# EAGLE design RPi_RN2483backup (EAGLE 7.6.0)
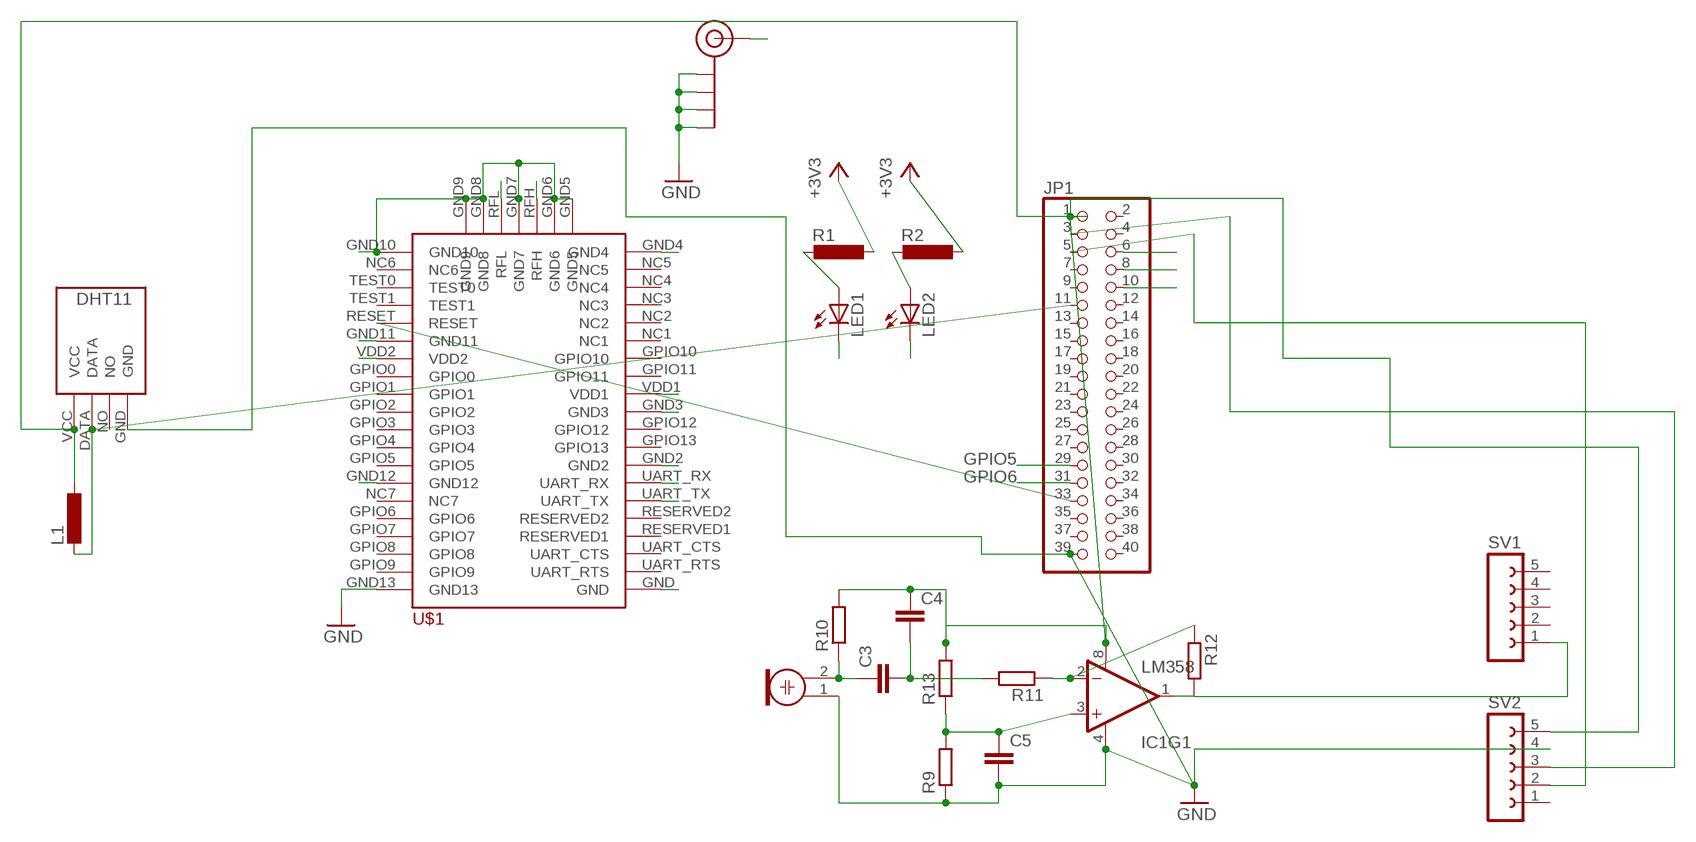
[diagram p0: schematic, sheet 1]

## Parts
C3  C-EU025-024X044  [C025-024X044]
C4  C-EU025-024X044  [C025-024X044]
C5  C-EU025-024X044  [C025-024X044]
IC1  LM358  [DIP08]
J$1  SMA_EDGE  [SMA-EDGE]
JP1  PINHD-2X20  [2X20]
L1  L-EU0204/7  [0204/7]
LED1  LED5MM  [LED5MM]
LED2  LED5MM  [LED5MM]
M1  ELECTRET_MICROPHON-F6050AP  [F6050AP]
R1  L-EU0204/7  [0204/7]
R2  L-EU0204/7  [0204/7]
R9  R-EU_0204/7  [0204/7]
R10  R-EU_0204/7  [0204/7]
R11  R-EU_0204/7  [0204/7]
R12  R-EU_0204/7  [0204/7]
R13  R-EU_0204/7  [0204/7]
SV1  FE05-1  [FE05-1]
SV2  FE05-1  [FE05-1]
U$1  RN2483  [RN2483]
U$3  DHT11-PION.  [DHT11-PION.]

## Nets
+3V3: C4.1 IC1.8(V+) JP1.1 L1.1 R1.1 R2.1 R10.2 R13.2 SV2.5 U$1.VDD1 U$1.VDD2 U$3.VCC
GND: J$1.GND@0(GND) J$1.GND@1(GND) J$1.GND@2(GND) J$1.GND@3(GND) U$1.GND U$1.GND2 U$1.GND3 U$1.GND4 U$1.GND5 U$1.GND6 U$1.GND7 U$1.GND8 U$1.GND9 U$1.GND10 U$1.GND11 U$1.GND12 U$1.GND13
GPIO5: JP1.29 LED1.K(C)
GPIO6: JP1.31 LED2.K(C)
GROUND: C5.2 IC1.4(V-) JP1.6 JP1.39 M1.1 R9.1 SV2.4 U$3.GND ; supply symbol labelled GND
N$1: LED1.A R1.2
N$2: LED2.A R2.2
N$7: U$1.RFL
N$10: JP1.11 L1.2 U$3.DATA
N$12: IC1.2(-IN) R11.1 R12.1
N$13: JP1.33 U$1.RESET
N$15: JP1.5 SV2.2
N$16: JP1.3 SV2.3
N$18: IC1.1(OUT) R12.2 SV1.1
N$22: C3.1 M1.2 R10.1
N$23: C3.2 C4.2 R11.2
N$24: C5.1 IC1.3(+IN) R9.2 R13.1
RFH: J$1.SIG(SIGNAL) U$1.RFH
UART_RX: JP1.8 U$1.UART_RX
UART_TX: JP1.10 U$1.UART_TX
Unconnected: IC1.5(+IN) IC1.6(-IN) IC1.7(OUT) JP1.2 JP1.4 JP1.7 JP1.9 JP1.12 JP1.13 JP1.14 JP1.15 JP1.16 JP1.17 JP1.18 JP1.19 JP1.20 JP1.21 JP1.22 JP1.23 JP1.24 JP1.25 JP1.26 JP1.27 JP1.28 JP1.30 JP1.32 JP1.34 JP1.35 JP1.36 JP1.37 JP1.38 JP1.40 SV1.2 SV1.3 SV1.4 SV1.5 SV2.1 U$1.GPIO0 U$1.GPIO1 U$1.GPIO2 U$1.GPIO3 U$1.GPIO4 U$1.GPIO5 U$1.GPIO6 U$1.GPIO7 U$1.GPIO8 U$1.GPIO9 U$1.GPIO10 U$1.GPIO11 U$1.GPIO12 U$1.GPIO13 U$1.NC1 U$1.NC2 U$1.NC3 U$1.NC4 U$1.NC5 U$1.NC6 U$1.NC7 U$1.RESERVED1 U$1.RESERVED2 U$1.TEST0 U$1.TEST1 U$1.UART_CTS U$1.UART_RTS U$3.NO

## Library data of the parts
C3-C5 = resistor:C-EU: CAPACITOR, European symbol
IC1 = SparkFun-AnalogIC:LM358: Jellybean op-amp; PROD_ID: IC-09172
J$1 = SparkFun-Connectors:SMA_EDGE: SMA Antenna Connector End launch SMA connector. The paste layer has been removed so that the connector can be hand soldered onto the board after reflow.
JP1 = adafruit:PINHD-2X20: PIN HEADER
L1 R1 R2 = resistor:L-EU: INDUCTOR, European symbol
LED1 LED2 = adafruit:LED: LED OSRAM: - CHIPLED LG R971, LG N971, LY N971, LG Q971, LY Q971, LO R971, LY R971 LH N974, LH R974 LS Q976, LO Q976, LY Q976 LO Q996 - Hyper CHIPLED LW Q18S LB Q993, LB Q99A, LB R99A - SideLED LS A670, LO A670, LY A670, LG A670, LP A670 LB A673, LV A673, LT A673, LW A673 LH A674 LY A675 LS A676, LA A676, LO A676, LY A676, LW A676 LS A679, LY A679, LG A679 - Hyper Micro SIDELED® LS Y876, LA Y876, LO Y876, LY Y876 LT Y87S - SmartLED LW L88C, LW L88S LB L89C, LB L89S, LG L890 LS L89K, LO L89K, LY L89K LS L896, LA L896, LO L896, LY L896 - TOPLED LS T670, LO T670, LY T670, LG T670, LP T670 LSG T670, LSP T670, LSY T670, LOP T670, LYG T670 LG T671, LOG T671, LSG T671 LB T673, LV T673, LT T673, LW T673 LH T674 LS T676, LA T676, LO T676, LY T676, LB T676, LH T676, LSB T676, LW T676 LB T67C, LV T67C, LT T67C, LS T67K, LO T67K, LY T67K, LW E67C LS E67B, LA E67B, LO E67B, LY E67B, LB E67C, LV E67C, LT E67C LW T67C LS T679, LY T679, LG T679 LS T770, LO T770, LY T770, LG T770, LP T770 LB T773, LV T773, LT T773, LW T773 LH T774 LS E675, LA E675, LY E675, LS T675 LS T776, LA T776, LO T776, LY T776, LB T776 LHGB T686 LT T68C, LB T68C - Hyper Mini TOPLED® LB M676 - Mini TOPLED Santana® LG M470 LS M47K, LO M47K, LY M47K Source: http://www.osram.convergy.de/
M1 = microphon:ELECTRET_MICROPHON-: Electret Condenser Microphone
R9-R13 = resistor:R-EU_: RESISTOR, European symbol
SV1 SV2 = con-lsta:FE05-1: FEMALE HEADER; OC_FARNELL: unknown; OC_NEWARK: unknown
U$1 = RN2483:RN2483: Microchip RN2483 LoRaWAN Module
U$3 = DHT11:DHT11-PION.: DHT11 Czujnik temperatury i wilgotności (widok pionowy)

## Module HDT11
Ports: 

### Library data of the parts

## Board
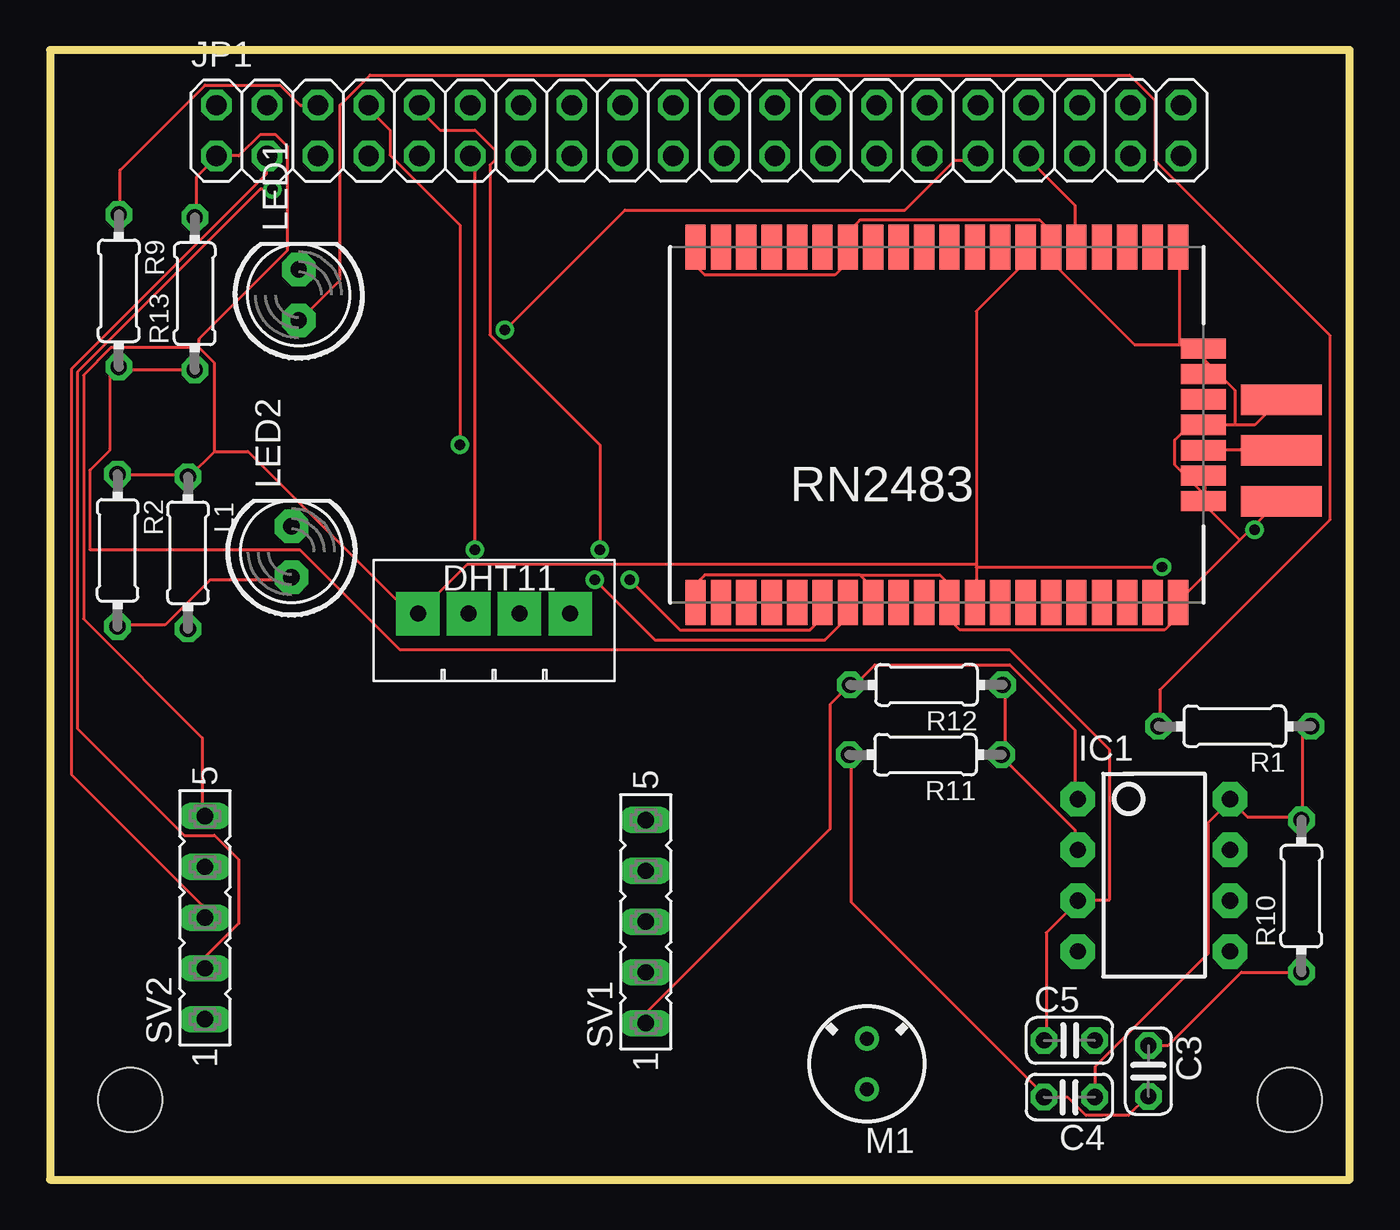
[diagram p1: board, top side]
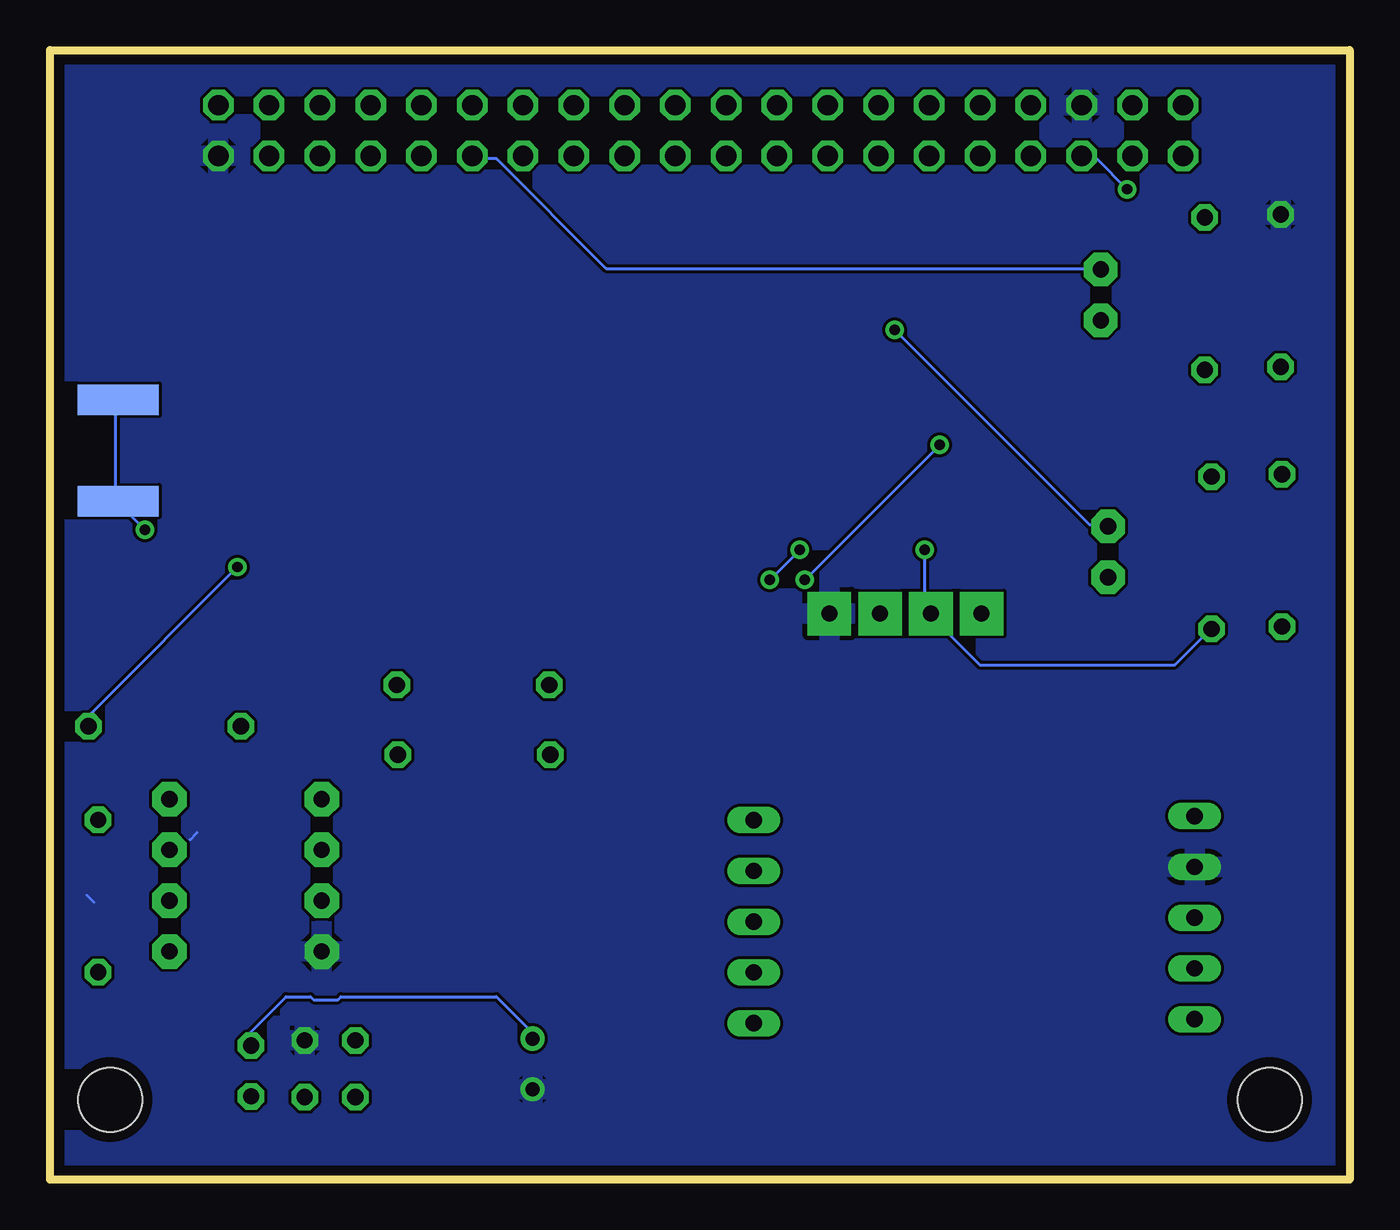
[diagram p2: board, bottom side, seen from below]

Size 65 x 56.5 mm. Coordinates in mm from the lower left corner, seen from the top.
Outline: 0,0 65,0 65,56.5 0,56.5 0,0
Copper layers (1*16): Top 0.035mm / dielectric 1.5mm / Bottom 0.035mm
Design rules "Ragworm": minimum track width 6mil, minimum drill 20mil, track to track 6mil, track to pad 6mil, pad to pad 6mil, via to via 6mil, smd to smd 6mil, copper to edge 20mil, drill to drill 8mil, minimum pad ring 10mil, minimum via ring 8mil, stop-mask expansion 4mil, vias tented up to drill 0mil, thermal gap 10mil
Holes 3.2 mm at 4,4 62,4

### Footprints (pad centres in the part's own frame; a part is rotated, then mirrored left to right if it is on the bottom)
C025-024X044 = drill 0.813 octagon: 1 -1.27,0; 2 1.27,0
DIP08 = drill 0.813 pad 1.727 octagon: 1 -3.81,-3.81; 2 -1.27,-3.81; 3 1.27,-3.81; 4 3.81,-3.81; 5 3.81,3.81; 6 1.27,3.81; 7 -1.27,3.81; 8 -3.81,3.81
SMA-EDGE = smd 1.524 x 4.064: GND@0 0,0; GND@1 5.08,0; SIG 2.54,0 | smd 1.524 x 4.064 bottom: GND@2 0,0; GND@3 5.08,0
2X20 = drill 1.016 octagon: 1 -24.13,-1.27; 2 -24.13,1.27; 3 -21.59,-1.27; 4 -21.59,1.27; 5 -19.05,-1.27; 6 -19.05,1.27; 7 -16.51,-1.27; 8 -16.51,1.27; 9 -13.97,-1.27; 10 -13.97,1.27; 11 -11.43,-1.27; 12 -11.43,1.27; 13 -8.89,-1.27; 14 -8.89,1.27; 15 -6.35,-1.27; 16 -6.35,1.27; 17 -3.81,-1.27; 18 -3.81,1.27; 19 -1.27,-1.27; 20 -1.27,1.27; 21 1.27,-1.27; 22 1.27,1.27; 23 3.81,-1.27; 24 3.81,1.27; 25 6.35,-1.27; 26 6.35,1.27; 27 8.89,-1.27; 28 8.89,1.27; 29 11.43,-1.27; 30 11.43,1.27; 31 13.97,-1.27; 32 13.97,1.27; 33 16.51,-1.27; 34 16.51,1.27; 35 19.05,-1.27; 36 19.05,1.27; 37 21.59,-1.27; 38 21.59,1.27; 39 24.13,-1.27; 40 24.13,1.27
0204/7 = drill 0.813 octagon: 1 -3.81,0; 2 3.81,0
LED5MM = drill 0.813 pad 1.676 octagon: A -1.27,0; K 1.27,0
F6050AP = drill 0.7 pad 1.2: 1 0,1.27; 2 0,-1.27
FE05-1 = drill 0.813 long: 1 -5.08,0; 2 -2.54,0; 3 0,0; 4 2.54,0; 5 5.08,0
RN2483 = smd 2.25 x 1.016: GND 17.78,1.27; GND2 17.78,10.16; GND3 17.78,13.97; GND4 17.78,25.4; GND10 0,25.4; GND11 0,19.05; GND12 0,8.89; GND13 0,1.27; GPIO0 0,16.51; GPIO1 0,15.24; GPIO2 0,13.97; GPIO3 0,12.7; GPIO4 0,11.43; GPIO5 0,10.16; GPIO6 0,6.35; GPIO7 0,5.08; GPIO8 0,3.81; GPIO9 0,2.54; GPIO10 17.78,17.78; GPIO11 17.78,16.51; GPIO12 17.78,12.7; GPIO13 17.78,11.43; NC1 17.78,19.05; NC2 17.78,20.32; NC3 17.78,21.59; NC4 17.78,22.86; NC5 17.78,24.13; NC6 0,24.13; NC7 0,7.62; RESERVED1 17.78,5.08; RESERVED2 17.78,6.35; RESET 0,20.32; TEST0 0,22.86; TEST1 0,21.59; UART_CTS 17.78,3.81; UART_RTS 17.78,2.54; UART_RX 17.78,8.89; UART_TX 17.78,7.62; VDD1 17.78,15.24; VDD2 0,17.78 | smd 1.016 x 2.25: GND5 12.7,26.67; GND6 11.43,26.67; GND7 8.89,26.67; GND8 6.35,26.67; GND9 5.08,26.67; RFH 10.16,26.67; RFL 7.62,26.67
DHT11-PION. = drill 0.8 pad 2.184 square: DATA -1.27,0.305; GND 3.81,0.305; NO 1.27,0.305; VCC -3.81,0.305

### Placement (x,y rotation side)
C3  54.94,5.43 270 top
C4  50.99,4.12 180 top
C5  50.99,6.96 0 top
IC1  55.22,15.22 270 top
J$1  61.59,39.01 270 top
JP1  32.45,52.47 0 top
L1  6.9,31.35 270 top
LED1  12.44,44.25 90 top
LED2  12.08,31.4 90 top
M1  40.86,5.78 180 top
R1  59.26,22.67 180 top
R2  3.38,31.47 270 top
R9  3.44,44.46 270 top
R10  62.59,14.18 90 top
R11  43.79,21.25 180 top
R12  43.84,24.74 180 top
R13  7.24,44.31 90 top
SV1  29.8,12.9 90 top
SV2  7.75,13.1 90 top
U$1  31.02,46.64 270 top
U$3  22.21,28 0 top

### Tracks (layer width: path | path; a pad name or v marks a point on that pad's centre or on a via)
+3V3  (via drill 0.51)
  Top 0.152: R13.2 7.32,48.16 7.32,50.14 8.23,51.05 JP1.1 8.38,51.21 9.45,51.21 10.52,52.27 11.28,52.27 11.89,51.66 11.89,46.48 7.47,42.06 7.47,41.6 | R2.1 3.5,35.25 6.75,35.25 L1.1 7.01,35.2 8.23,36.42 | 46.33,30.79 46.33,43.43 48.77,45.87 48.77,46.63 U$1.VDD2 | 46.33,30.79 46.33,30.63 | 46.33,30.63 46.33,28.96 U$1.VDD1 | 7.47,41.6 3.05,41.6 1.68,40.23 1.68,28.04 7.62,22.1 7.62,18.29 SV2.5 | 7.47,41.6 8.23,40.84 8.23,36.42 | 8.23,36.42 9.91,36.42 17.98,28.35 18.29,28.35 U$3.VCC 18.44,28.35 20.88,30.79 46.33,30.79 | 46.33,30.63 v55.63,30.63 | C4.1 52.27,4.27 52.27,5.64 57.91,11.28 57.91,17.83 58.98,18.9 IC1.8 59.13,18.9 59.89,18.14 62.48,18.14 R10.2 62.64,18.14 62.64,22.25 62.94,22.55 R1.1
  Bottom 0.152: v55.63,30.63 62.94,23.32 62.94,22.71 R1.1
GND  (via drill 0.51)
  Top 0.152: 59.25,37.75 60.25,37.75 61.5,39 J$1.GND@2 | 59.25,37.75 U$1.GND7 57,37.75 56.25,37 56.25,35.75 57.75,34.25 | U$1.GND13 32.5,46.5 32.5,45.5 32.75,45.25 39.25,45.25 39.75,45.75 39.75,46.5 U$1.GND12 40,46.75 40,47.5 40.5,48 49.5,48 50,47.5 50,46.75 U$1.GND11 50.25,46.5 50.25,45.75 54.25,41.75 56.5,41.75 | 57.75,41 57.75,41.5 U$1.GND9 57.5,41.75 56.5,41.75 | 57.75,41 57.75,40.5 U$1.GND8 | 56.5,41.75 56.5,46.5 U$1.GND10 | 59.25,37.75 59.25,39.5 57.75,41 | 40.5,30.25 32.75,30.25 32.5,30 32.5,29 U$1.GND | 40.5,30.25 41,29.75 41,29 U$1.GND2 | 40.5,30.25 44.5,30.25 44.75,30 44.75,29 U$1.GND3 45,28.75 45,28 45.5,27.5 55.75,27.5 56.25,28 56.25,28.75 U$1.GND4 56.5,29 59.5,32 | 57.75,34.25 57.75,35 U$1.GND6 | 57.75,34.25 57.75,34 U$1.GND5 | 60,32.5 61.5,34 J$1.GND@3 | 60,32.5 59.5,32 | 59.5,32 57.75,33.75 U$1.GND5 | 60,32.5 v60.25,32.5 | 57.75,34.25 U$1.GND5
  Bottom 0.152: J$1.GND@2 61.75,39 61.75,34 J$1.GND@3 61.5,33.75 v60.25,32.5
GPIO5
  Bottom 0.152: JP1.29 43.74,51.05 42.67,51.05 37.19,45.57 12.5,45.57 LED1.K
GPIO6  (via drill 0.51)
  Top 0.152: v22.75,42.5 28.75,48.5 42.75,48.5 45.25,51 46.25,51 JP1.31
  Bottom 0.152: v22.75,42.5 13,32.75 12.25,32.75 LED2.K
GROUND
  Top 0.152: JP1.6 13.25,53.75 12.5,53.75 11.5,54.75 7.75,54.75 3.5,50.5 3.5,48.5 R9.1
  Bottom 0.152: 62.79,13.87 63.14,14.22 | 58,17 57.66,17.34
  pour Bottom: 0.9,55.9 0.75,55.9 0.75,0.75 64.25,0.75 64.25,0.9 64.25,55.9
N$1
  Top 0.152: R1.2 55.5,22.75 55.5,24.5 64,33 64,42.25 55.25,51 55.25,54 54,55.25 16,55.25 14.5,53.75 14.5,45 12.5,43 LED1.A
N$2
  Top 0.152: R2.2 3.5,27.75 5.75,27.75 8,30 12,30 LED2.A
N$10  (via drill 0.51)
  Top 0.152: v21.25,31.5 21.25,51 JP1.11
  Bottom 0.152: L1.2 7,27.5 8.75,25.75 18.5,25.75 21,28.25 U$3.DATA 21,28.5 21.25,28.5 v21.25,31.5
N$12
  Top 0.152: R12.1 47.75,24.5 47.75,21.25 R11.1 47.5,21.25 51.25,17.5 51.25,16.5 IC1.2
N$13
  Top 0.152: U$1.RESET 51.25,46.75 51.25,48.75 49,51 JP1.33
N$14
  Bottom 1.016: 13.45,53.7 13.4,53.7
N$15  (via drill 0.51)
  Top 0.152: v11.12,49.53 10.52,49.53 1.37,40.39 1.37,22.55 6.71,17.22 8.23,17.22 9.45,16 9.45,12.8 7.77,11.12 7.77,10.67 SV2.2
  Bottom 0.152: v11.12,49.53 12.65,51.05 13.26,51.05 JP1.5
N$16
  Top 0.152: SV2.3 7.62,13.11 7.62,13.72 1.07,20.27 1.07,40.54 10.82,50.29 10.82,51.05 JP1.3
N$18
  Top 0.152: IC1.1 51.25,19.25 51.25,22.5 48,25.75 41.25,25.75 40.25,24.75 R12.2 39.93,24.69 39.01,23.77 39.01,17.53 29.87,8.38 29.87,7.92 SV1.1
N$22
  Top 0.152: R10.1 62.48,10.36 59.59,10.36 55.93,6.71 55.02,6.71 C3.1
  Bottom 0.152: M1.2 41,7.16 41,7.47 42.67,9.14 50.44,9.14 50.6,8.99 51.82,8.99 51.97,9.14 53.19,9.14 55.02,7.32 55.02,6.71 C3.1
N$23
  Top 0.152: C3.2 54.86,4.12 53.95,3.2 51.82,3.2 50.9,4.12 49.84,4.12 C4.2 49.68,4.27 40.08,13.87 40.08,21.18 R11.2
N$24
  Top 0.152: R13.1 3.5,40.5 R9.2 3,40.5 3,36.5 2,35.5 2,31.5 12.5,31.5 17.5,26.5 48,26.5 53,21.5 53,14 51.5,14 IC1.3 51.36,13.87 49.84,12.34 49.84,7.01 C5.1
RFH
  Top 0.152: U$1.RFH 57.75,36.5 61.5,36.5 J$1.SIG
UART_RX  (via drill 0.51)
  Top 0.152: v27.25,30 30.25,27 38.75,27 39.75,28 39.75,28.75 U$1.UART_RX | v20.5,36.75 20.5,47.75 17,51.25 17,52.5 16,53.5 JP1.8
  Bottom 0.152: v20.5,36.75 v27.25,30
UART_TX  (via drill 0.51)
  Top 0.152: v29,30 31.5,27.5 38,27.5 38.5,28 38.5,28.75 U$1.UART_TX | v27.5,31.5 27.5,36.75 22,42.25 22,50.75 22.25,51 22.25,51.5 21.25,52.5 19.5,52.5 18.5,53.5 JP1.10
  Bottom 0.152: v27.5,31.5 v29,30

### Text on the board
tNames: RN2483